# Altium schematic sheet 4_COMMUNICATION.SchDoc
size 420 x 297 mm; SheetNumber: 4; SheetTotal: 7
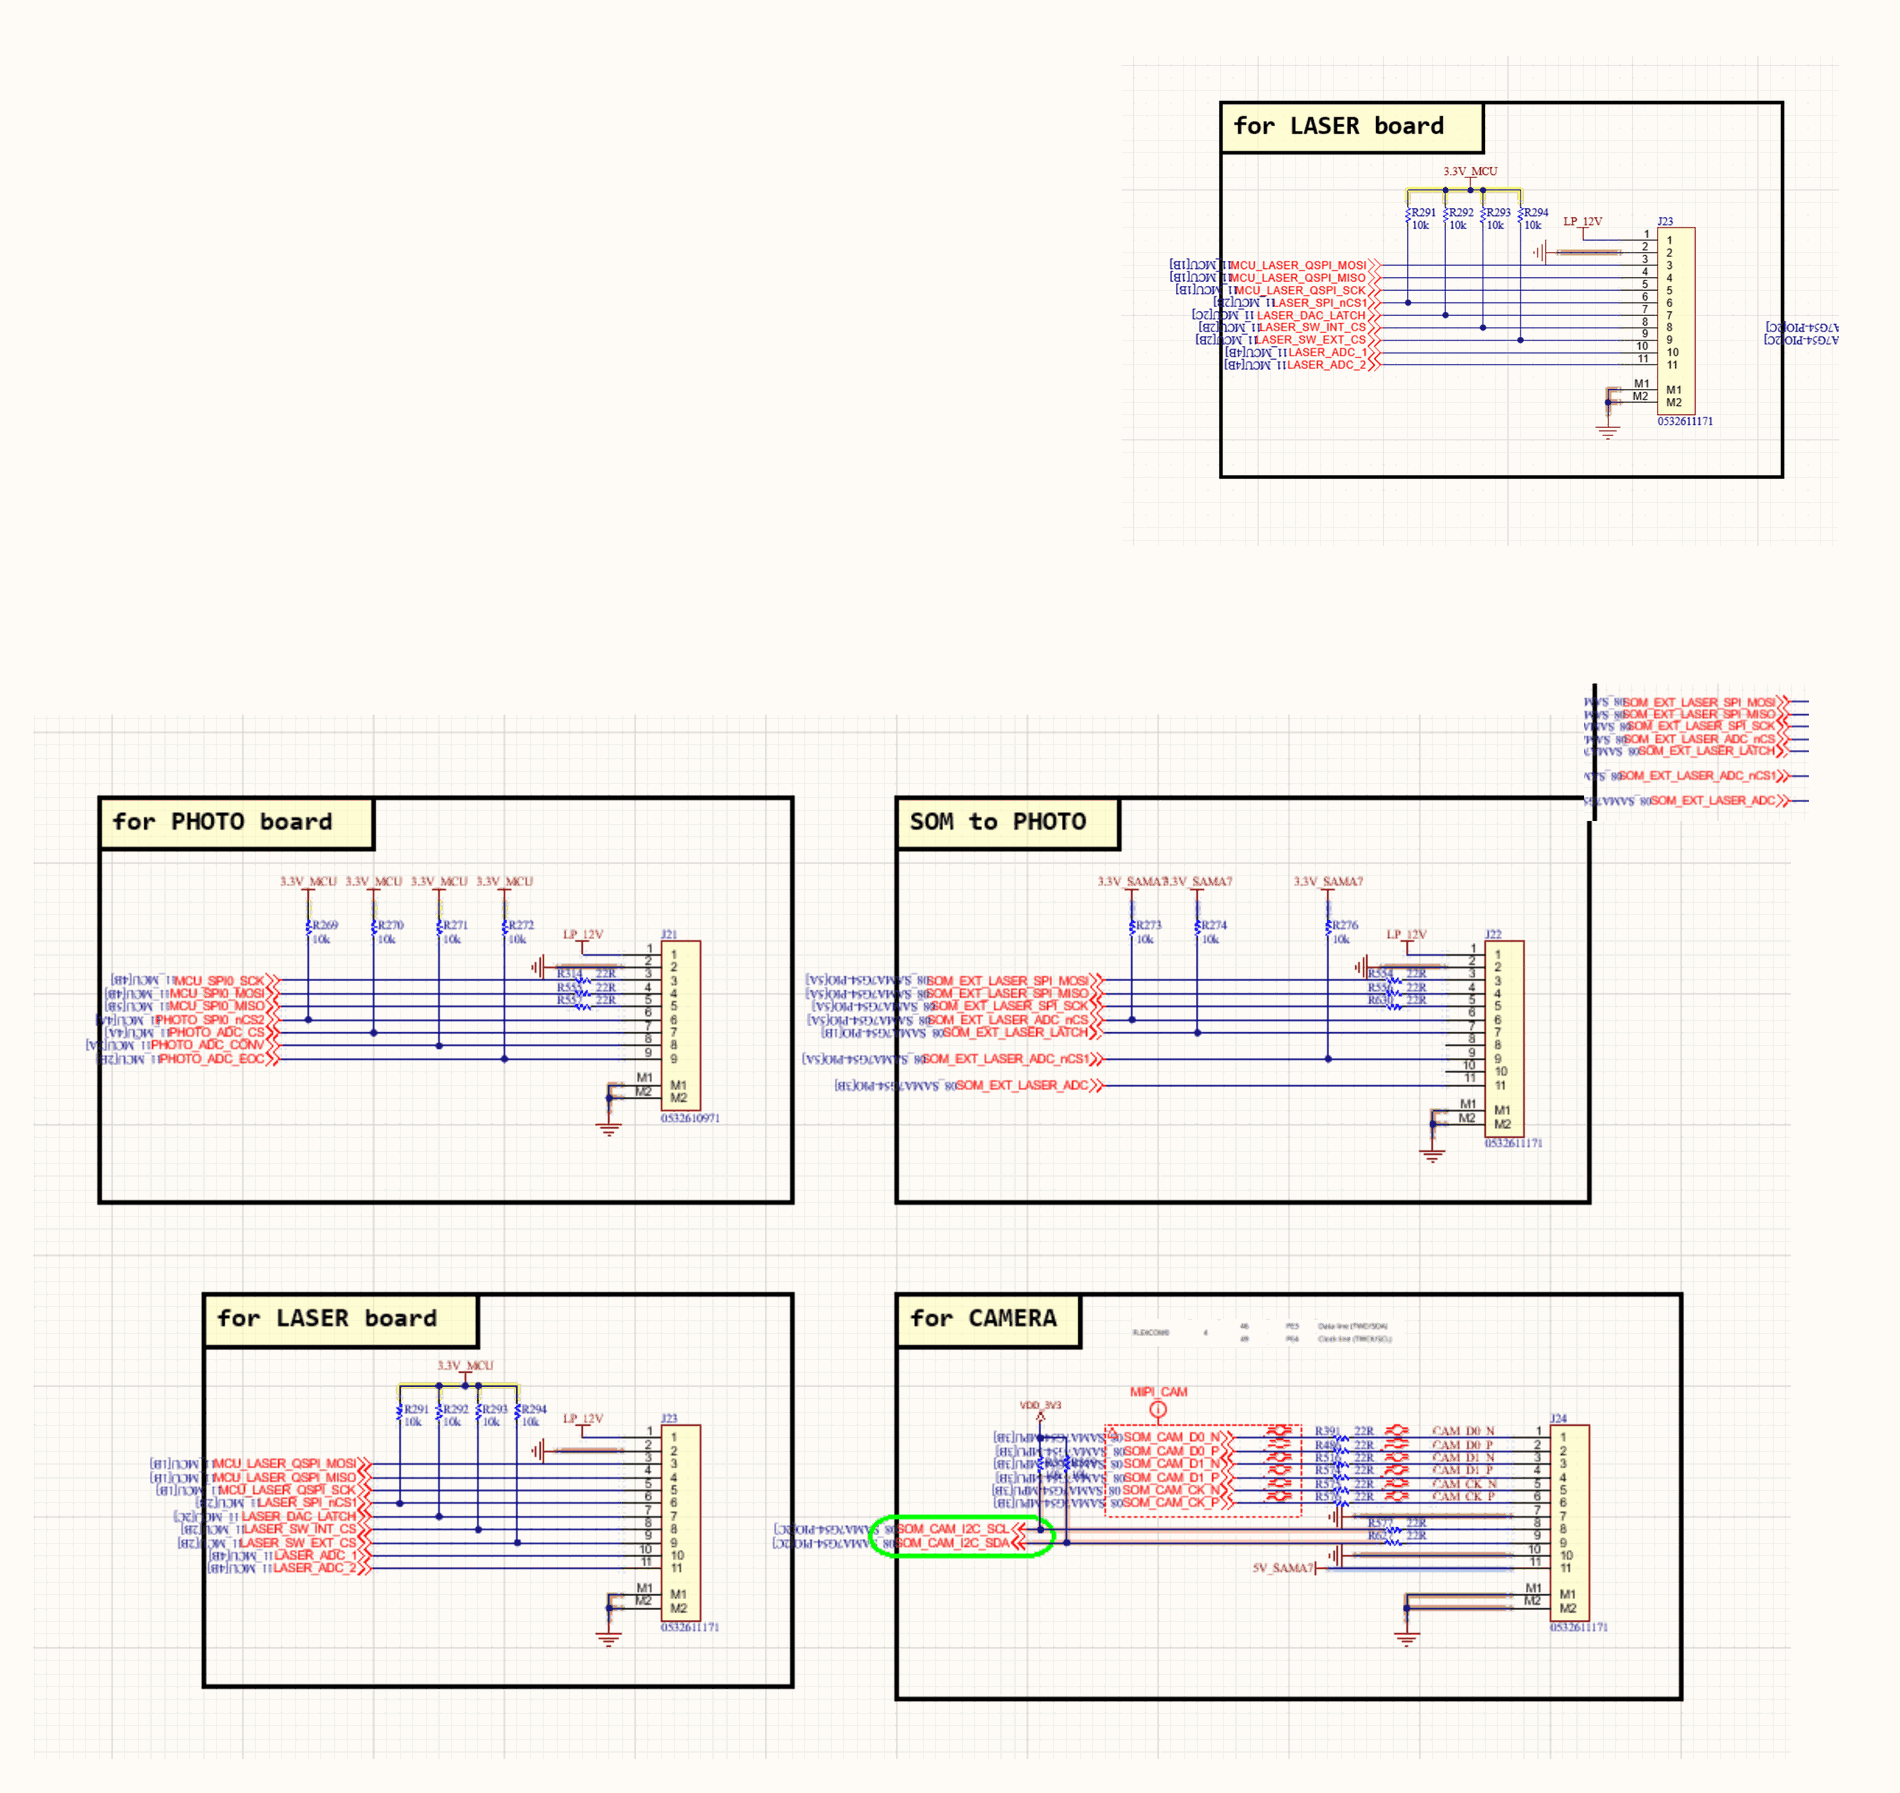
[diagram p0: 4_COMMUNICATION.SchDoc, left]
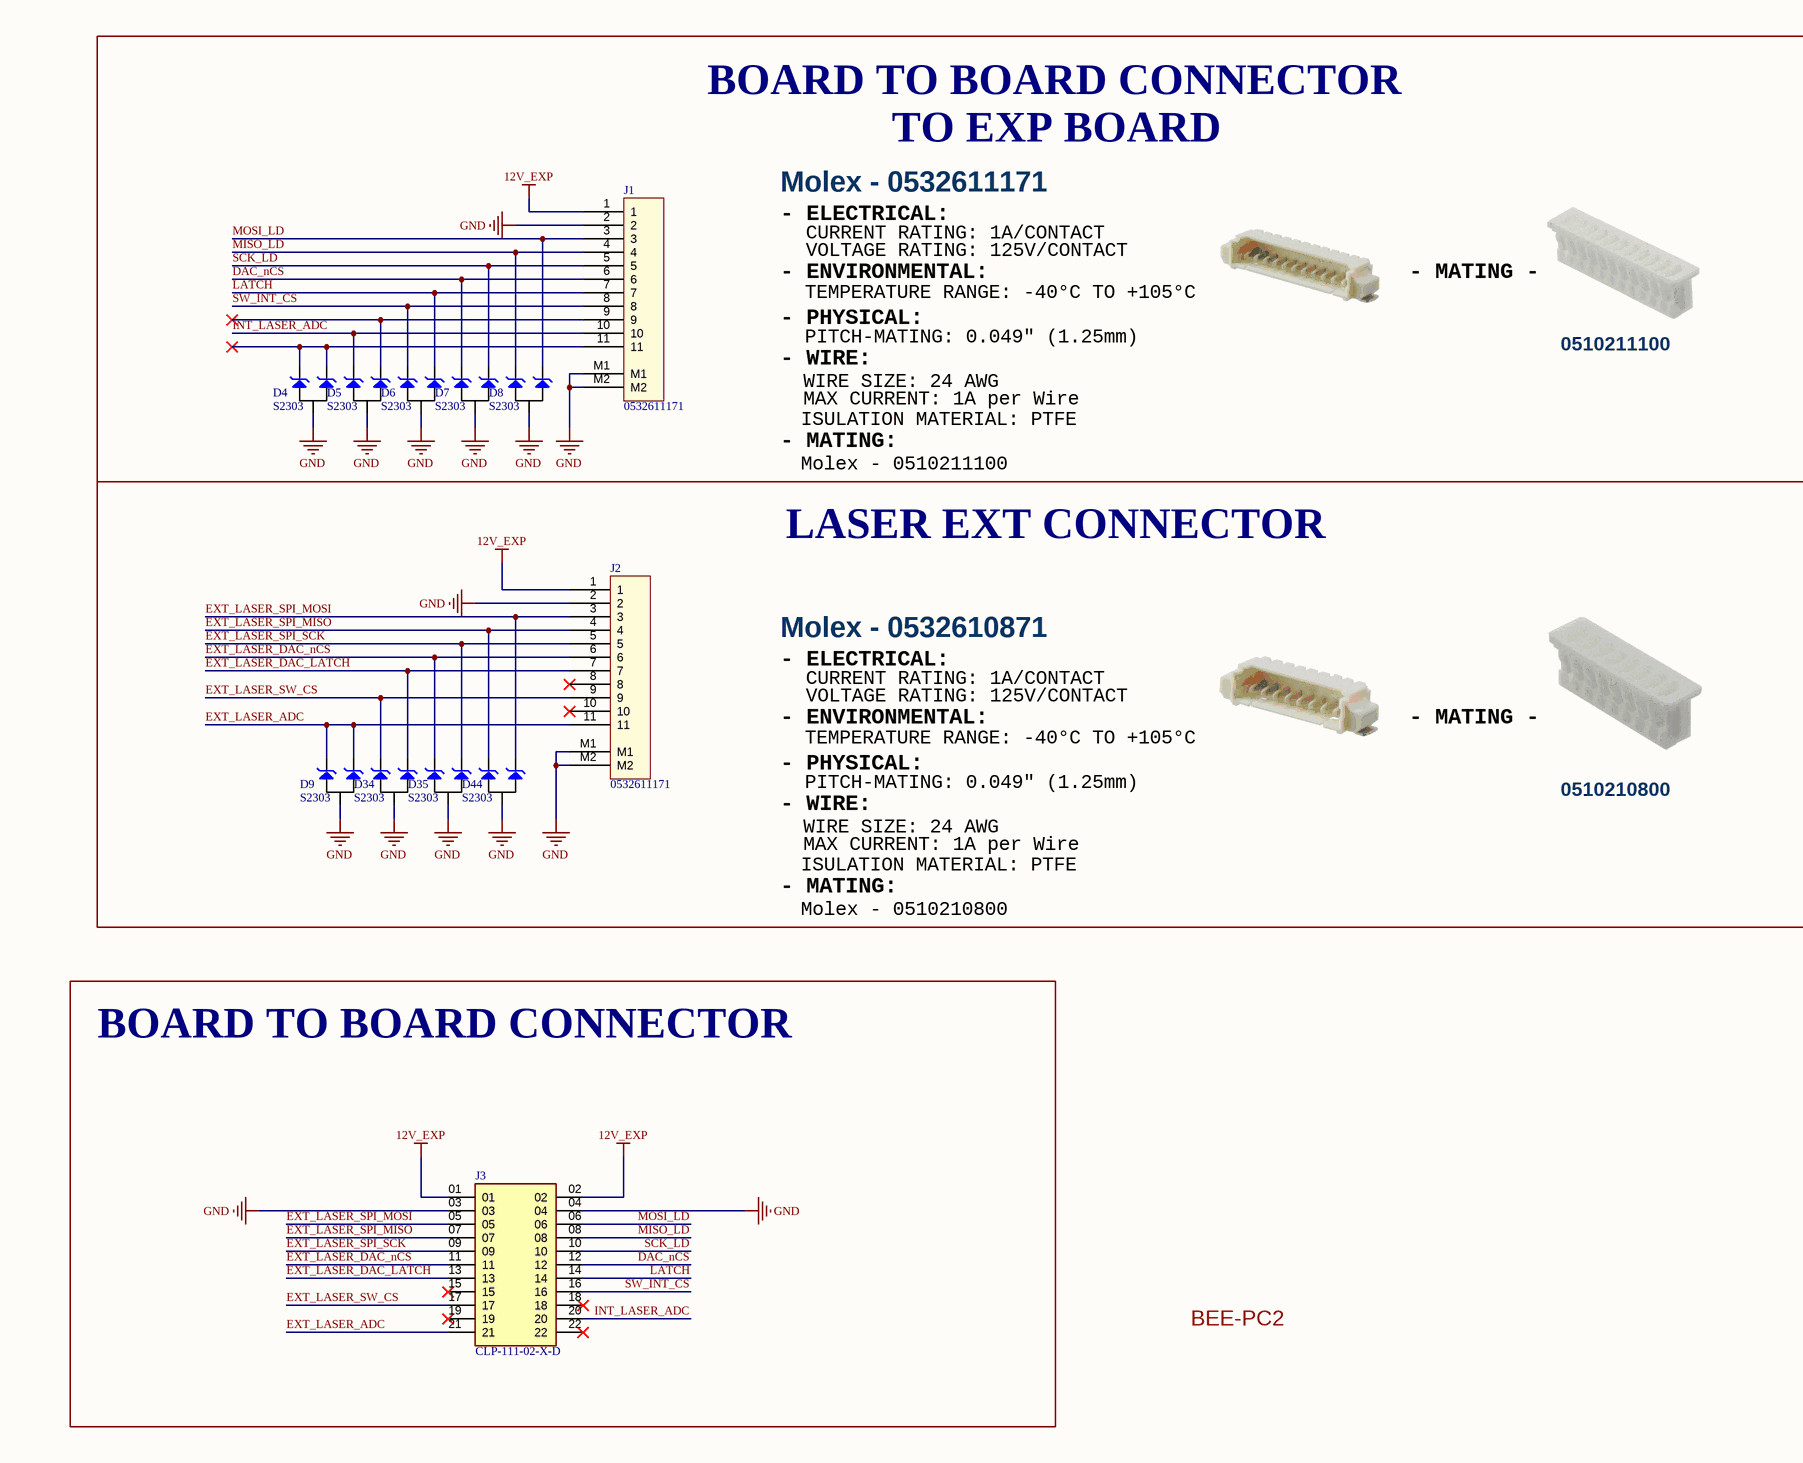
[diagram p1: 4_COMMUNICATION.SchDoc, right]

## Parts
D4  S2303  [SOT23-3-132]
D5  S2303  [SOT23-3-132]
D6  S2303  [SOT23-3-132]
D7  S2303  [SOT23-3-132]
D8  S2303  [SOT23-3-132]
D9  S2303  [SOT23-3-132]
D34  S2303  [SOT23-3-132]
D35  S2303  [SOT23-3-132]
D44  S2303  [SOT23-3-132]
J1  0532611171  [MOLEX_0532611171]
J2  0532611171  [MOLEX_0532611171]
J3  CLP-111-02-X-D  [SAMTEC_CLP-111-02-X-D]

## Blocks framed on the sheet
LASER EXT CONNECTOR: D9 D34 D35 D44 J2
BOARD TO BOARD CONNECTOR: J3

## Nets
12V_EXP: J1.1 J2.1 J3.01 J3.02
GND: D4.3 D5.3 D6.3 D7.3 D8.3 D9.3 D34.3 D35.3 D44.3 J1.2 J1.M1 J1.M2 J2.2 J2.M1 J2.M2 J3.03 J3.04
DAC_nCS: D7.2 J1.6 J3.12
EXT_LASER_ADC: D9.1 D9.2 J2.11 J3.21
EXT_LASER_DAC_LATCH: D34.1 J2.7 J3.13
EXT_LASER_DAC_nCS: D35.2 J2.6 J3.11
EXT_LASER_SPI_MISO: D44.2 J2.4 J3.07
EXT_LASER_SPI_MOSI: D44.1 J2.3 J3.05
EXT_LASER_SPI_SCK: D35.1 J2.5 J3.09
EXT_LASER_SW_CS: D34.2 J2.9 J3.17
INT_LASER_ADC: D5.2 J1.10 J3.20
LATCH: D6.1 J1.7 J3.14
MISO_LD: D8.2 J1.4 J3.08
MOSI_LD: D8.1 J1.3 J3.06
SCK_LD: D7.1 J1.5 J3.10
SW_INT_CS: D6.2 J1.8 J3.16
NetD4_1: D4.1 D4.2 J1.11
NetD5_1: D5.1 J1.9

Not connected (* = marked no-connect by the designer): J2 8* 10*; J3 15* 18* 19* 22*

## Notes on the sheet
- BOARD TO BOARD CONNECTOR
- Molex - 0532611171
- TO EXP BOARD
- - ELECTRICAL:
- - ENVIRONMENTAL:
- CURRENT RATING: 1A/CONTACT
- VOLTAGE RATING: 125V/CONTACT
- - MATING -
- - PHYSICAL:
- TEMPERATURE RANGE: -40°C TO +105°C
- PITCH-MATING: 0.049" (1.25mm)
- - WIRE:
- WIRE SIZE: 24 AWG
- MAX CURRENT: 1A per Wire
- 0510211100
- - MATING:
- ISULATION MATERIAL: PTFE
- Molex - 0510211100
- Molex - 0532610871
- 0510210800
- Molex - 0510210800
- BEE-PC2
- Project:
- Sub-system:
- Design by:
- Sheet title:
- Sheet
- A3
- of
- Checked by:
- Approved by:
- Revision:
- Document No:
- Size:
- Date:

## Library data of the parts
J1 J2 = Header 11x1_2M
J3 = CLP-111-02-X-D: CLP - Samtec 1.27mm Tiger Claw Rugged Reliable Dual Wipe Socket Strip; MP: CLP-111-02-L-D; SnapEDA_Link: https://www.snapeda.com/parts/CLP-111-02-L-D/Samtec/view-part/?ref=snap; Package: None; Value: *; MF: Samtec; Check_prices: https://www.snapeda.com/parts/CLP-111-02-L-D/Samtec/view-part/?ref=eda